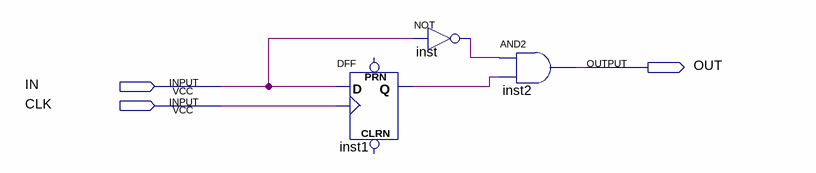
[diagram p0: schematic sheet]
// Quartus schematic InstantFallingEdge.bdf as structural Verilog: 3 symbols, 3 pins
module InstantFallingEdge (
  input  IN,
  input  CLK,
  output OUT
);

  wire inst1_q, inst_out;

  DFF inst1 (.CLK(CLK), .D(IN), .Q(inst1_q));  // open: CLRN, PRN
  not inst (inst_out, IN);
  and inst2 (OUT, inst_out, inst1_q);
endmodule
